# EAGLE schematic KeyboardController (EAGLE 7.7.0)
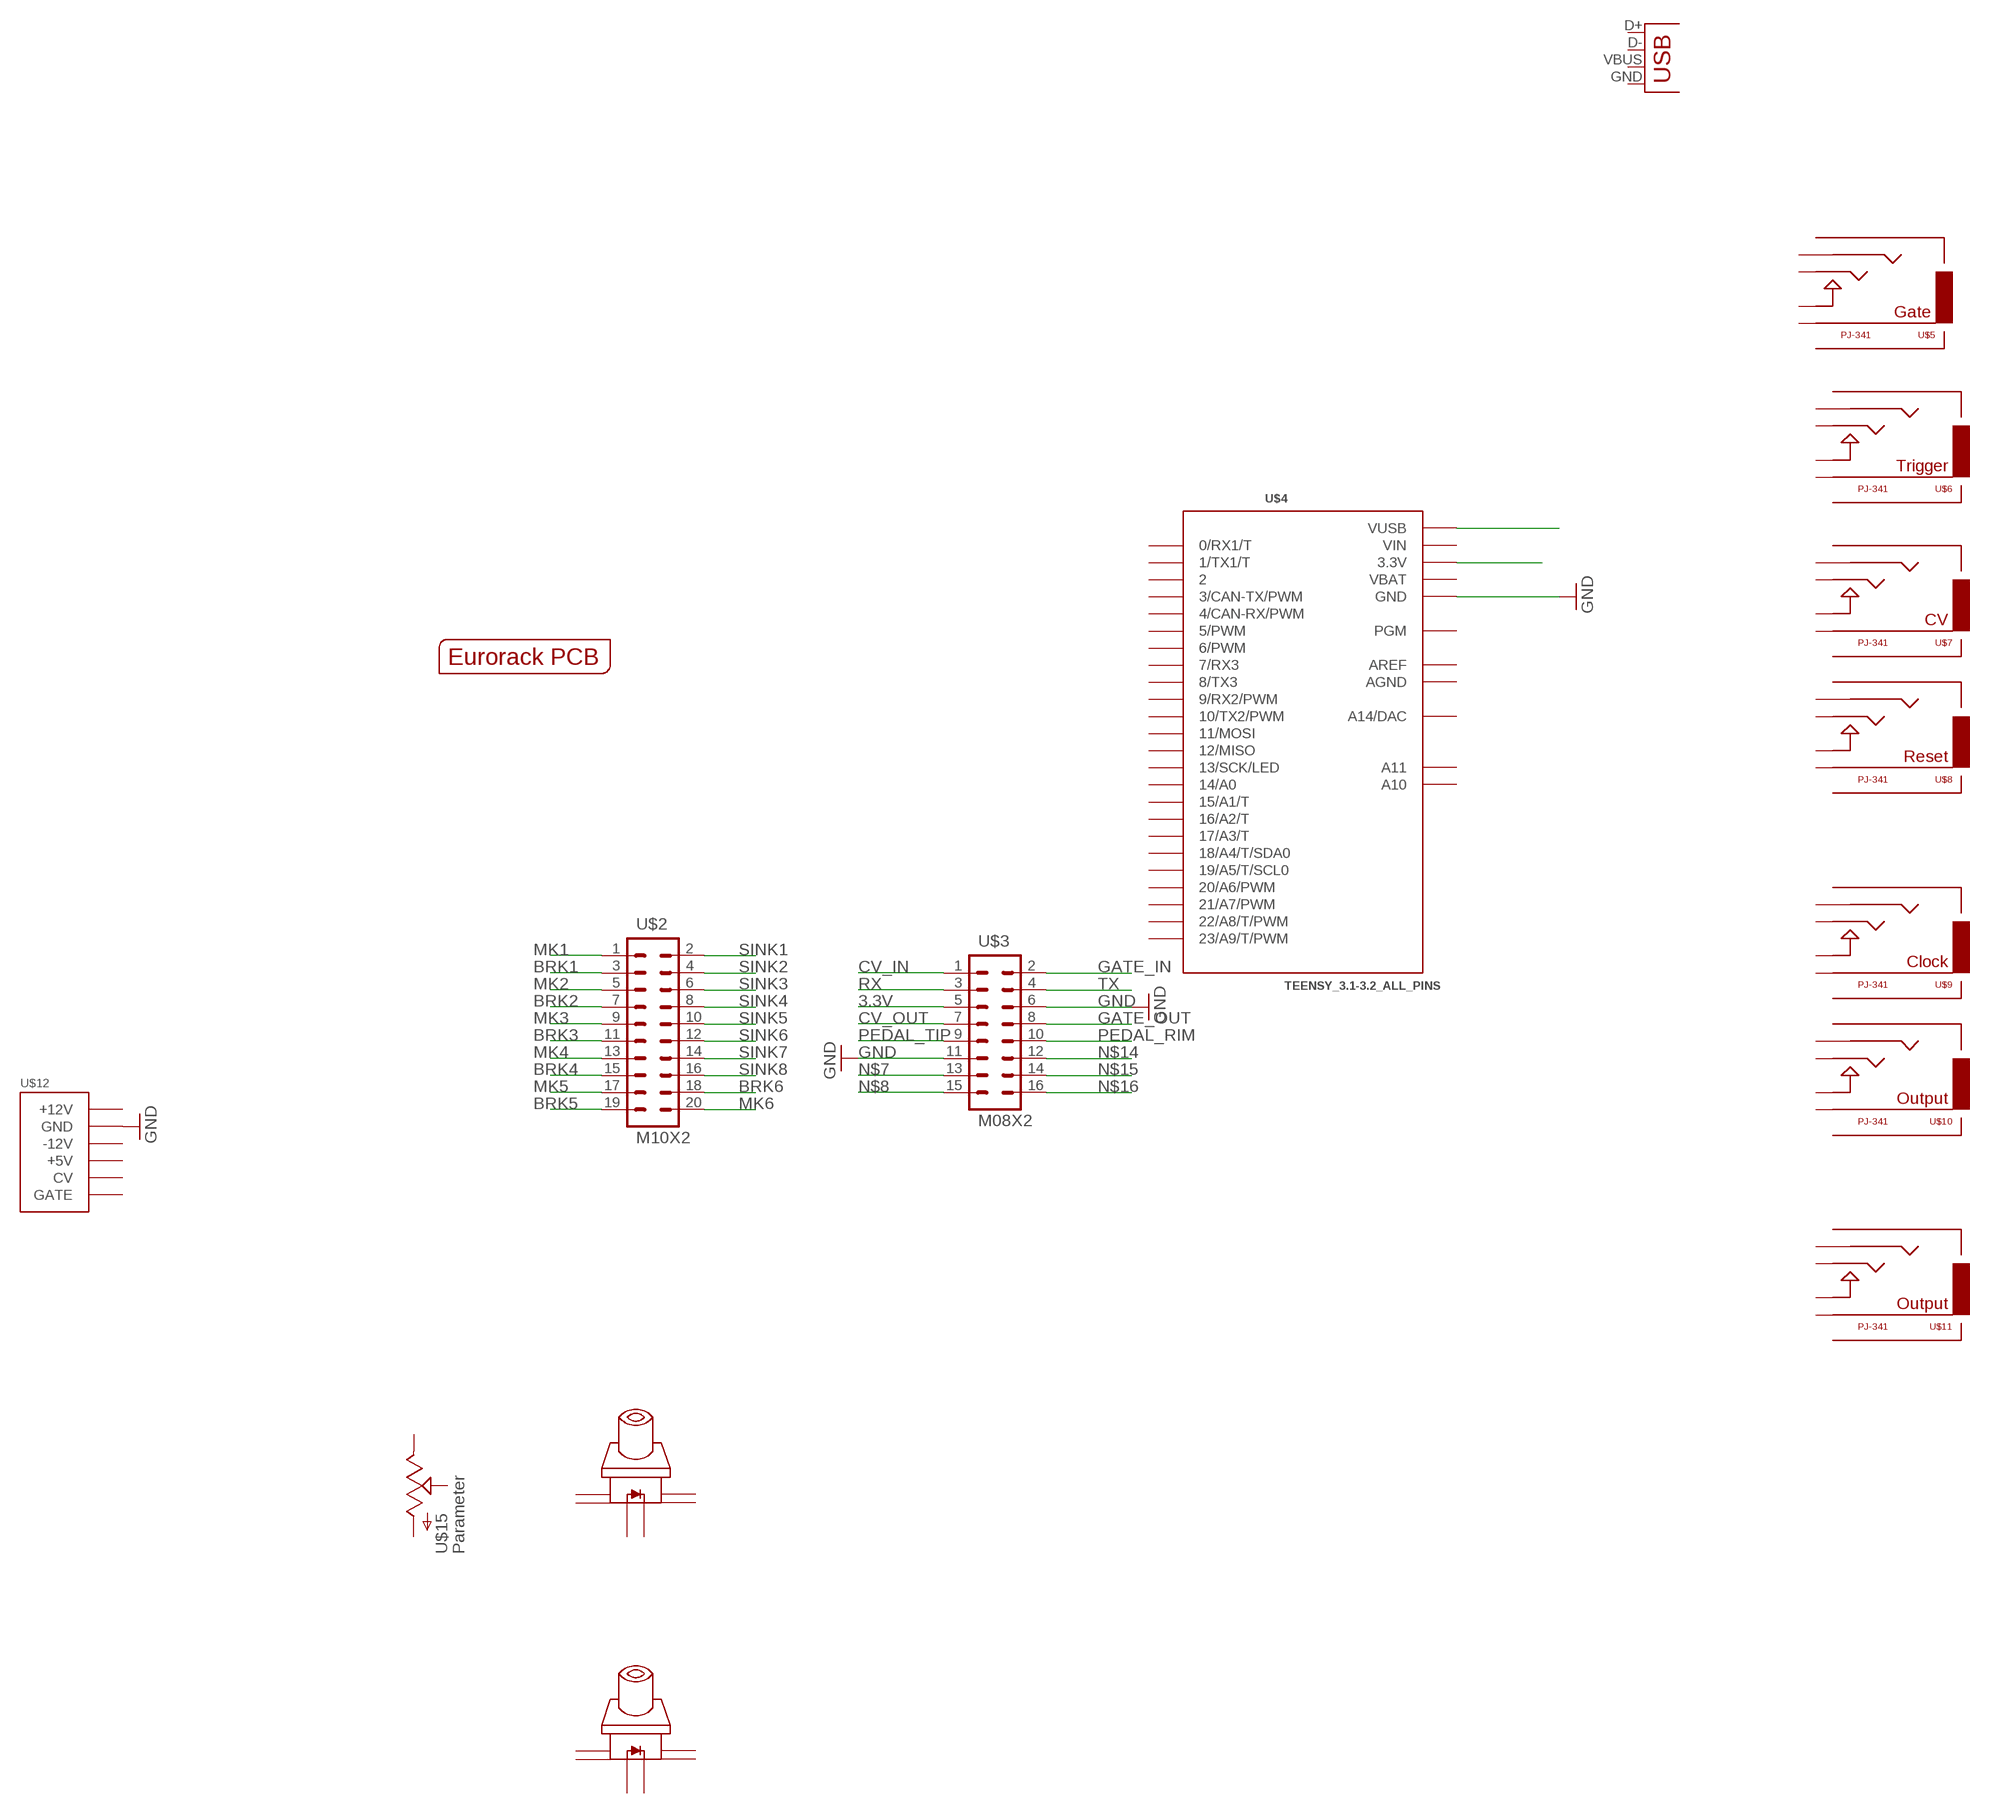
[diagram p0: schematic, sheet 1]

## Parts
JP1  USBPTH-VERTICAL  [USB-B-PTH-VERTICAL]
U$1  EURORACK_PCB20HP_10X10CM  [EURORACK20HP_10X10CM]
U$2  M10X2  [2X10]
U$3  M08X2  [2X8]
U$4  TEENSY_3.1-3.2_ALL_PINS  [TEENSY_3.0-3.2&LC_ALL_PINS]
U$5  PJ-341  AUDIO-JACKOUTPUT  [3.5MM-JACK-SWITCH-13MM-OUTPUT]
U$6  PJ-341  AUDIO-JACKOUTPUT  [3.5MM-JACK-SWITCH-13MM-OUTPUT]
U$7  PJ-341  AUDIO-JACKOUTPUT  [3.5MM-JACK-SWITCH-13MM-OUTPUT]
U$8  PJ-341  AUDIO-JACKOUTPUT  [3.5MM-JACK-SWITCH-13MM-OUTPUT]
U$9  PJ-341  AUDIO-JACKOUTPUT  [3.5MM-JACK-SWITCH-13MM-OUTPUT]
U$10  PJ-341  AUDIO-JACKOUTPUT  [3.5MM-JACK-SWITCH-13MM-OUTPUT]
U$11  PJ-341  AUDIO-JACKOUTPUT  [3.5MM-JACK-SWITCH-13MM-OUTPUT]
U$12  POWERSHROUDED  [POWER_16_SHROUDED]
U$13  SWITCH_W_LED_PB6149L-X-102YELLOW  [PB6149L]
U$14  SWITCH_W_LED_PB6149L-X-102YELLOW  [PB6149L]
U$15  POTZEPHPOT  [OG-POTS_ALPS_POT_VERTICAL]

## Nets
3.3V: U$3.5 U$4.3.3V U$4.3.3V1(3.3V)
BRK1: U$2.3
BRK2: U$2.7
BRK3: U$2.11
BRK4: U$2.15
BRK5: U$2.19
BRK6: U$2.18
CV_IN: U$3.1
CV_OUT: U$3.7
GATE_IN: U$3.2
GATE_OUT: U$3.8
GND: U$3.6 U$3.11 U$4.GND U$4.GND1(GND) U$12.3(GND) U$12.4(GND) U$12.5(GND) U$12.6(GND) U$12.7(GND) U$12.8(GND)
MK1: U$2.1
MK2: U$2.5
MK3: U$2.9
MK4: U$2.13
MK5: U$2.17
MK6: U$2.20
N$2: U$4.VUSB
N$7: U$3.13
N$8: U$3.15
N$14: U$3.12
N$15: U$3.14
N$16: U$3.16
PEDAL_RIM: U$3.10
PEDAL_TIP: U$3.9
RX: U$3.3
SINK1: U$2.2
SINK2: U$2.4
SINK3: U$2.6
SINK4: U$2.8
SINK5: U$2.10
SINK6: U$2.12
SINK7: U$2.14
SINK8: U$2.16
TX: U$3.4
Unconnected: JP1.D+ JP1.D- JP1.GND JP1.VBUS U$4.0(0/RX1/T) U$4.1(1/TX1/T) U$4.2 U$4.3(3/CAN-TX/PWM) U$4.4(4/CAN-RX/PWM) U$4.5(5/PWM) U$4.6(6/PWM) U$4.7(7/RX3) U$4.8(8/TX3) U$4.9(9/RX2/PWM) U$4.10(10/TX2/PWM) U$4.11(11/MOSI) U$4.12(12/MISO) U$4.13(13/SCK/LED) U$4.14/A0 U$4.15/A1(15/A1/T) U$4.16/A2(16/A2/T) U$4.17/A3(17/A3/T) U$4.18/A4(18/A4/T/SDA0) U$4.19/A5(19/A5/T/SCL0) U$4.20/A6(20/A6/PWM) U$4.21/A7(21/A7/PWM) U$4.22/A8(22/A8/T/PWM) U$4.23/A9(23/A9/T/PWM) U$4.A10 U$4.A11 U$4.PGM U$4.RESET/DAC(A14/DAC) U$5.RING@3(RING) U$5.SECOND@3(SECOND) U$5.SWITCH@3(SWITCH) U$5.TIP@3(TIP) U$6.RING@3(RING) U$6.SECOND@3(SECOND) U$6.SWITCH@3(SWITCH) U$6.TIP@3(TIP) U$7.RING@3(RING) U$7.SECOND@3(SECOND) U$7.SWITCH@3(SWITCH) U$7.TIP@3(TIP) U$8.RING@3(RING) U$8.SECOND@3(SECOND) U$8.SWITCH@3(SWITCH) U$8.TIP@3(TIP) U$9.RING@3(RING) U$9.SECOND@3(SECOND) U$9.SWITCH@3(SWITCH) U$9.TIP@3(TIP) U$10.RING@3(RING) U$10.SECOND@3(SECOND) U$10.SWITCH@3(SWITCH) U$10.TIP@3(TIP) U$11.RING@3(RING) U$11.SECOND@3(SECOND) U$11.SWITCH@3(SWITCH) U$11.TIP@3(TIP) U$12.1(-12V) U$12.2(-12V) U$12.9(+12V) U$12.10(+12V) U$12.11(+5V) U$12.12(+5V) U$12.13(CV) U$12.14(CV) U$12.15(GATE) U$12.16(GATE) U$13.1 U$13.2 U$13.3 U$13.4 U$13.LEDNEG(NEG) U$13.LEDPOS(POS) U$14.1 U$14.2 U$14.3 U$14.4 U$14.LEDNEG(NEG) U$14.LEDPOS(POS) U$15.P$1(E) U$15.P$2(S) U$15.P$3(A)

## Power pins joined to a net without a drawn wire
AGND: U$4.AGND
AREF: U$4.AREF
VBAT: U$4.VBAT
VIN: U$4.VIN

## Library data of the parts
JP1 = SparkFun-Connectors:USB: USB Connectors USB-B-PTH is fully proven SKU : PRT-00139/CONN-08278 USB-miniB is fully proven SKU : PRT-00587 USB-A-PCB is untested. USB-A-H is throughly reviewed, but untested. Spark Fun Electronics SKU : PRT-00437 USB-B-SMT is throughly reviewed, but untested. Needs silkscreen touching up. USB-A-S has not been used/tested USB-MB-H has not been used/tested USB-MICROB has been used. CONN-09505
U$1 = EurorackModularParts:EURORACK_PCB
U$2 = SparkFun-Connectors:M10X2: This was SPECIALLY designed to be used with our Graphic LCD Backpack. Be sure you want to use this! It is not only staggered on each line of header holes, but IT IS ALSO offset of the center point of the top and bottom lines by 5 mil. This causes the headers to lock into place on the "standard" footprint on the LCD screen. The extra squares on the tdocu layer are there simply to reference other pins (if you were to actually populate a longer header than ten long - this is what we do with the backpacks).
U$3 = SparkFun-Connectors:M08X2: .1" headers, two rows of 8 each
U$4 = Teensy_3_and_LC_Series_Boards_v1.4:TEENSY_3.1-3.2_ALL_PINS: Footprint for Teensy 3.1 or 3.2 board using all through-holes, i.e. the entire perimeter plus the 4 through-holes inboard (A10,A11,AREF, VUSB)
U$5 = EurorackModularParts:AUDIO-JACK: Switching Mono 3.5mm Audio Jack from Erthenvar.; DESC: Gate; MPN: PJ-341
U$6 = EurorackModularParts:AUDIO-JACK: Switching Mono 3.5mm Audio Jack from Erthenvar.; DESC: Trigger; MPN: PJ-341
U$7 = EurorackModularParts:AUDIO-JACK: Switching Mono 3.5mm Audio Jack from Erthenvar.; DESC: CV; MPN: PJ-341
U$8 = EurorackModularParts:AUDIO-JACK: Switching Mono 3.5mm Audio Jack from Erthenvar.; DESC: Reset; MPN: PJ-341
U$9 = EurorackModularParts:AUDIO-JACK: Switching Mono 3.5mm Audio Jack from Erthenvar.; DESC: Clock; MPN: PJ-341
U$10 U$11 = EurorackModularParts:AUDIO-JACK: Switching Mono 3.5mm Audio Jack from Erthenvar.; DESC: Output; MPN: PJ-341
U$12 = EurorackModularParts:POWER
U$13 U$14 = zephod-components:SWITCH_W_LED_PB6149L-X-102
U$15 = EurorackModularParts:POT; DESC: Parameter